# EAGLE design Motor Driver (EAGLE 6.4)
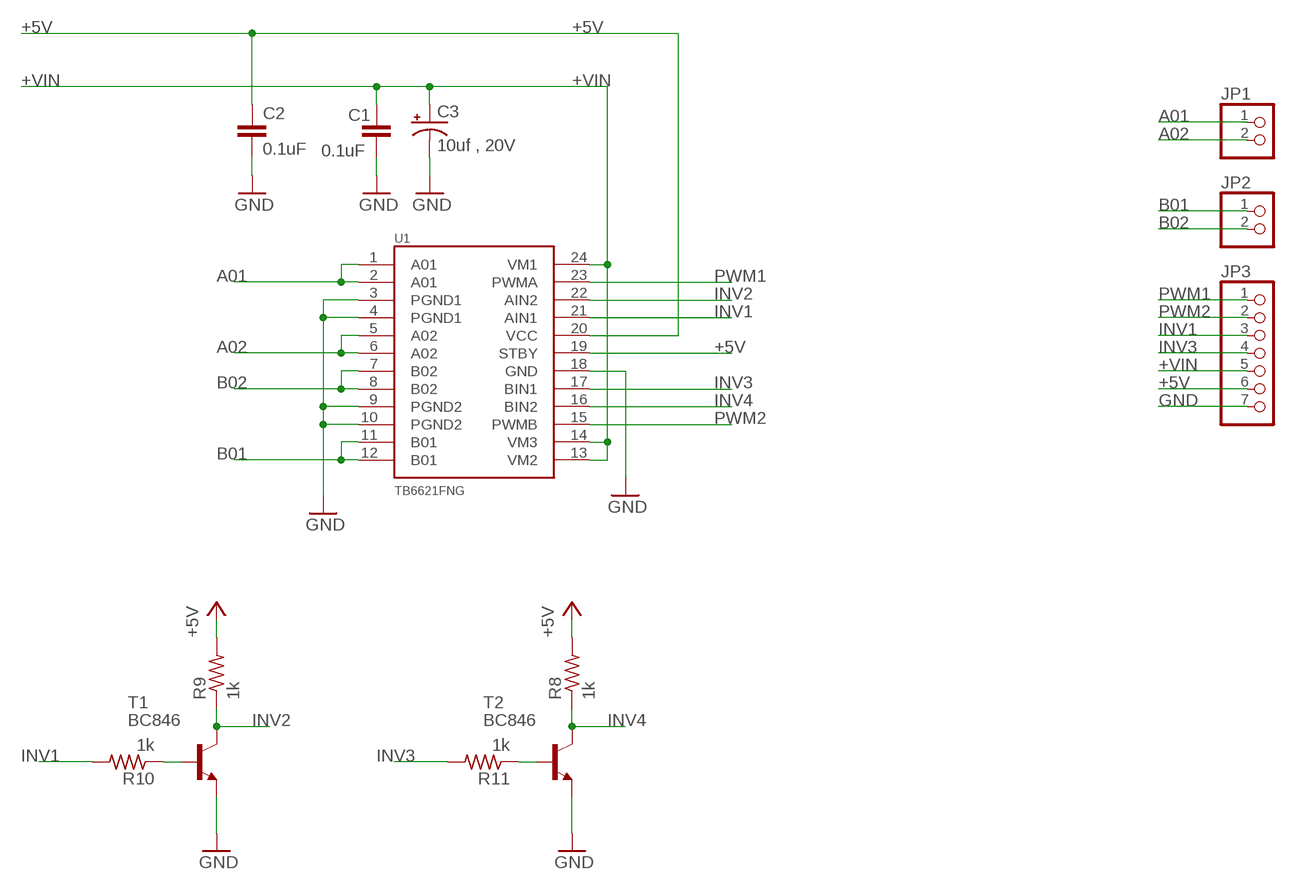
[diagram p0: schematic, sheet 1]

## Parts
C1  0.1uF  CAP0402-CAP  [0402-CAP]
C2  0.1uF  CAP0402-CAP  [0402-CAP]
C3  10uf , 20V  CAP_POL3528  [EIA3528]
JP1  PINHD-1X2  [1X02]
JP2  PINHD-1X2  [1X02]
JP3  PINHD-1X7  [1X07]
R8  1k  R-US_R0603  [R0603]
R9  1k  R-US_R0603  [R0603]
R10  1k  R-US_R0603  [R0603]
R11  1k  R-US_R0603  [R0603]
T1  BC846  [SOT23]
T2  BC846  [SOT23]
U1  TB6621FNG  [SSOP24]

## Nets
+5V [power]: C2.1 JP3.6 R8.2 R9.2 U1.19(STBY) U1.20(VCC)
+VIN [power]: C1.1 C3.A(+) JP3.5 U1.13(VM2) U1.14(VM3) U1.24(VM1)
A01: JP1.1 U1.1(A01) U1.2(A01)
A02: JP1.2 U1.5(A02) U1.6(A02)
B01: JP2.1 U1.11(B01) U1.12(B01)
B02: JP2.2 U1.7(B02) U1.8(B02)
GND [gnd]: C1.2 C2.2 C3.C(-) JP3.7 T1.2(E) T2.2(E) U1.3(PGND1) U1.4(PGND1) U1.9(PGND2) U1.10(PGND2) U1.18(GND)
INV1: JP3.3 R10.2 U1.21(AIN1)
INV2: R9.1 T1.3(C) U1.22(AIN2)
INV3: JP3.4 R11.2 U1.17(BIN1)
INV4: R8.1 T2.3(C) U1.16(BIN2)
N$3: R10.1 T1.1(B)
N$4: R11.1 T2.1(B)
PWM1: JP3.1 U1.23(PWMA)
PWM2: JP3.2 U1.15(PWMB)

## Library data of the parts
C1 C2 = SparkFun:CAP: Capacitor Standard 0603 ceramic capacitor, and 0.1" leaded capacitor.
C3 = SparkFun:CAP_POL: Capacitor Polarized These are standard SMD and PTH capacitors. Normally 10uF, 47uF, and 100uF in electrolytic and tantalum varieties. Always verify the external diameter of the through hole cap, it varies with capacity, voltage, and manufacturer. The EIA devices should be standard.
JP1 JP2 = pinhead:PINHD-1X2: PIN HEADER
JP3 = pinhead:PINHD-1X7: PIN HEADER
R8-R11 = rcl:R-US_: RESISTOR, American symbol
T1 T2 = transistor:BC846: NPN TRANSISTOR
U1 = SparkFun:TB6621FNG: Toshiba 1A motor driver

## Net classes
0 default: width 0.254 mm, drill 0.305 mm, clearance 0.254 mm
1 power: width 0.508 mm, drill 0.61 mm, clearance 0.254 mm
2 gnd: width 0.508 mm, drill 0.61 mm, clearance 0.254 mm

## Board
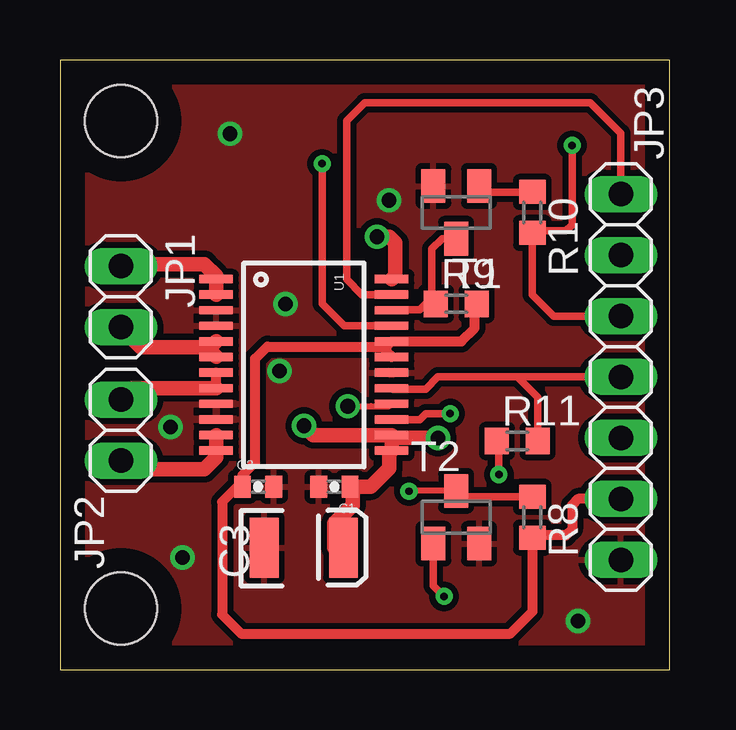
[diagram p1: board, top side]
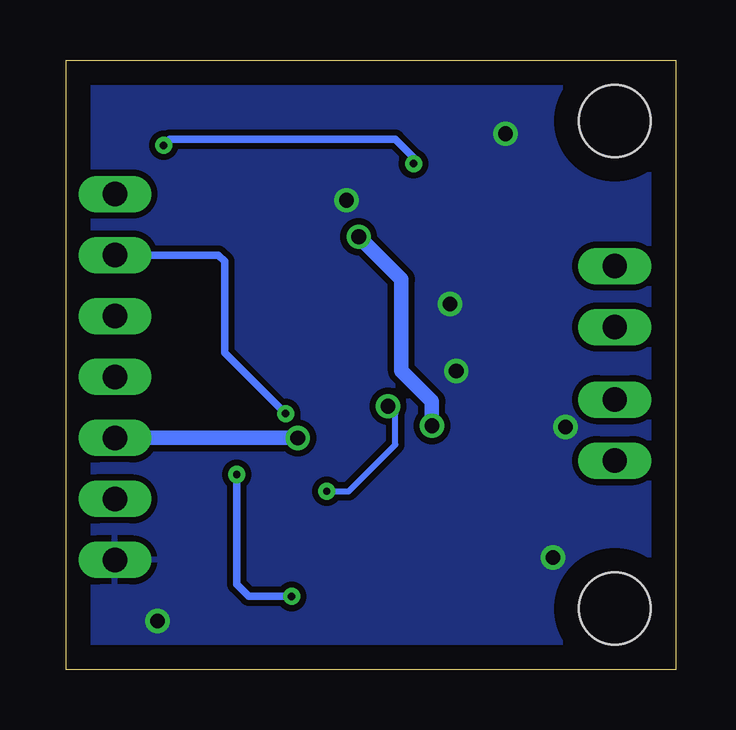
[diagram p2: board, bottom side, seen from below]

Size 25.4 x 25.4 mm. Coordinates in mm from the lower left corner, seen from the top.
Outline: 0,0 25.4,0 25.4,25.4 0,25.4 0,0
Copper layers (1*16): Top 0.035mm / dielectric 1.5mm / Bottom 0.035mm
Design rules "default": minimum track width 10mil, minimum drill 24mil, track to track 8mil, track to pad 8mil, pad to pad 8mil, via to via 8mil, smd to smd 8mil, copper to edge 40mil, drill to drill 8mil, minimum pad ring 10mil, minimum via ring 8mil, stop-mask expansion 4mil, vias tented up to drill 0mil, thermal gap 10mil
Holes 3 mm at 2.54,2.54 2.54,22.86

### Footprints (pad centres in the part's own frame; a part is rotated, then mirrored left to right if it is on the bottom)
0402-CAP = smd 0.7 x 0.9: 1 -0.65,0; 2 0.65,0
EIA3528 = smd 1.2 x 2.5: A 1.65,0; C -1.65,0
1X02 = drill 1.016 long: 1 -1.27,0; 2 1.27,0
1X07 = drill 1.016 long: 1 -7.62,0; 2 -5.08,0; 3 -2.54,0; 4 0,0; 5 2.54,0; 6 5.08,0; 7 7.62,0
R0603 = smd 1 x 1.1: 1 -0.85,0; 2 0.85,0
SOT23 = smd 1 x 1.4: 1 -0.95,-1.1; 2 0.95,-1.1; 3 0,1.1
SSOP24 = smd 0.348 x 1.397: 1 -3.575,-3.656; 2 -2.925,-3.656; 3 -2.275,-3.656; 4 -1.625,-3.656; 5 -0.975,-3.656; 6 -0.325,-3.656; 7 0.325,-3.656; 8 0.975,-3.656; 9 1.625,-3.656; 10 2.275,-3.656; 11 2.925,-3.656; 12 3.575,-3.656; 13 3.575,3.656; 14 2.925,3.656; 15 2.275,3.656; 16 1.625,3.656; 17 0.975,3.656; 18 0.325,3.656; 19 -0.325,3.656; 20 -0.975,3.656; 21 -1.625,3.656; 22 -2.275,3.656; 23 -2.925,3.656; 24 -3.575,3.656

### Placement (x,y rotation side)
C1  11.43,7.62 180 top
C2  8.26,7.62 0 top
C3  10.16,5.08 0 top
JP1  2.54,15.54 270 top
JP2  2.54,9.98 90 top
JP3  23.37,12.19 270 top
R8  19.68,6.35 270 top
R9  16.51,15.24 0 top
R10  19.68,19.05 270 top
R11  19.05,9.53 0 top
T1  16.51,19.05 180 top
T2  16.51,6.35 0 top
U1  10.16,12.7 270 top

### Tracks (layer width: path | path; a pad name or v marks a point on that pad's centre or on a via)
+5V
  Top 0.406: 13.6,13.46 8.64,13.46 8.13,12.95 8.13,8.64 7.61,8.11 C2.1 7.39,7.62 6.76,6.99 6.76,2.29 7.54,1.5 18.77,1.5 19.68,2.41 R8.2 19.77,5.59 21.08,5.59 21.34,5.84 21.34,6.86 21.59,7.11 JP3.6 | 13.6,13.46 U1.20 16.72,13.68 17.27,14.22 17.27,15.15 R9.2 | 13.6,13.46 13.6,13.24 U1.19
+VIN  (via drill 0.61)
  Top 0.61: U1.14 U1.13 13.72,9.03 13.72,8.38 12.95,7.62 C1.1 12.19,7.51 12.19,6.86 11.43,6.1 11.43,5.08 C3.A | v15.75,9.65 13.94,9.65 U1.14 | U1.14 10.54,9.78 v10.16,10.16 | v13.21,18.03 13.72,18.03 13.97,17.78 13.97,16.43 U1.24
  Bottom 0.61: JP3.5 v15.75,9.65 | v10.16,10.16 10.16,11.18 11.43,12.45 11.43,16.26 v13.21,18.03
A01
  Top 0.61: U1.1 U1.2 6.5,16.41 6.02,16.89 2.62,16.89 JP1.1
A02
  Top 0.61: 6.09,13.44 U1.6 | 6.09,13.44 6.27,13.44 U1.5 | 6.09,13.44 3.37,13.44 JP1.2
B01
  Top 0.61: U1.12 U1.11 6.5,8.84 6.02,8.36 2.89,8.36 JP2.1
B02
  Top 0.406: U1.8 U1.7
  Top 0.61: U1.8 3.02,11.72 JP2.2
GND  (via drill 0.61)
  other vias: 5.11,4.67 21.59,2.03 7.09,22.33 13.72,19.56 9.4,15.24 9.14,12.45 4.6,10.11
  pour Top: 6.3,10.26 5.61,10.26 5.61,11.2 7.19,11.2 7.19,10.29 6.35,10.29 6.35,10.26
  pour Top: 0,0 0,25.4 25.4,25.4 25.4,0
  pour Bottom: 0,0 0,25.4 25.4,25.4 25.4,0
INV1  (via drill 0.3)
  Top 0.305: JP3.3 20.57,14.73 19.68,15.62 R10.2 19.77,18.29 21.08,18.29 21.34,18.54 v21.34,21.84 | U1.21 11.84,14.32 10.92,15.24 v10.92,21.08
  Bottom 0.305: v10.92,21.08 10.92,21.34 11.68,22.1 21.08,22.1 v21.34,21.84
INV2
  Top 0.305: T1.3 15.92,17.95 15.49,17.53 15.49,15.41 R9.1 15.24,15.24 14.99,14.99 13.83,14.99 U1.22
INV3
  Top 0.305: JP3.4 19.05,12.19 | 19.05,12.19 15.75,12.19 15.24,11.68 13.86,11.68 U1.17 | R11.2 19.9,11.34 19.05,12.19
INV4  (via drill 0.3, 0.61)
  Top 0.254: T2.3 14.54,7.45 14.53,7.44 v14.54,7.43 | v11.99,10.97 12.95,10.97 12.96,10.98 13.72,10.98 U1.16
  Top 0.305: R8.1 16.76,7.2 T2.3 16.34,7.62
  Bottom 0.254: v14.54,7.43 13.63,7.43 11.68,9.37 11.68,10.67 v11.99,10.97
N$3
  Top 0.305: R10.1 17.71,19.9 T1.1
N$4  (via drill 0.3)
  Top 0.305: T2.1 15.56,3.49 v16,3.05 | v18.29,8.13 18.29,9.44 R11.1
  Bottom 0.305: v16,3.05 17.78,3.05 18.29,3.56 v18.29,8.13
PWM1
  Top 0.305: U1.23 12.57,15.62 11.94,16.26 11.94,22.86 12.7,23.62 22.1,23.62 23.37,22.35 JP3.1
PWM2  (via drill 0.3)
  Top 0.305: v16.26,10.67 15.24,10.67 14.99,10.41 U1.15
  Bottom 0.305: JP3.2 19.05,17.27 18.8,17.02 18.8,13.21 v16.26,10.67